# Altium schematic sheet STM32F103RxT_simple.SchDoc
size A4
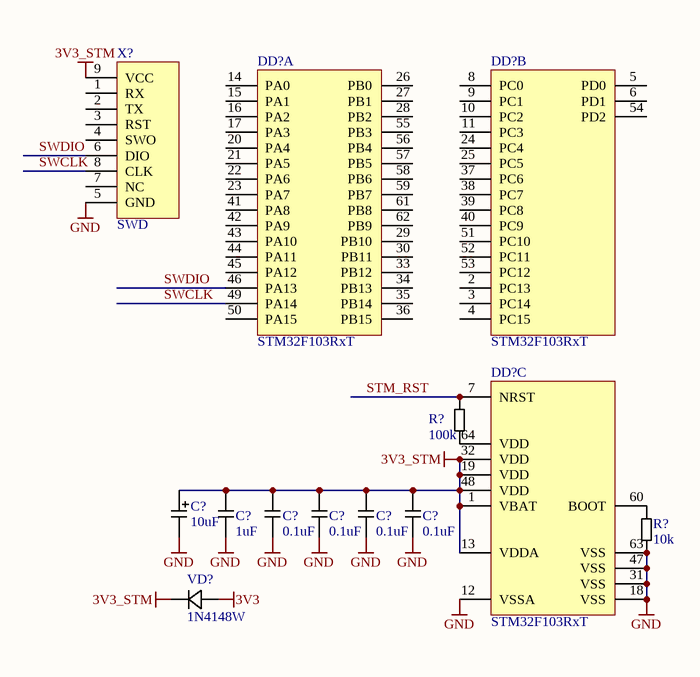
[diagram p0: STM32F103RxT_simple.SchDoc]

## Parts
(Parts that share a designator on the sheet are numbered #1, #2 ... from top to bottom, then left to right.)
C?#1  10uF  [SMD A]
C?#2  1uF  [C0603]
C?#3  0.1uF  [C0603]
C?#4  0.1uF  [C0603]
C?#5  0.1uF  [C0603]
C?#6  0.1uF  [C0603]
DD?#1  STM32F103RxT  [LQFP-64]  (part A of 3)
DD?#2  STM32F103RxT  [LQFP-64]  (part B of 3)
DD?#3  STM32F103RxT  [LQFP-64]  (part C of 3)
R?#1  100k  [R0603]
R?#2  10k  [R0603]
VD?  1N4148W  [SOD-123]
X?  SWD  [PogoSWD]

## Nets
3V3: VD?.1(K)
3V3_STM: C?#1.1 C?#2.1 C?#3.1 C?#4.1 C?#5.1 C?#6.1 DD?#3.1(VBAT) DD?#3.13(VDDA) DD?#3.19(VDD) DD?#3.32(VDD) DD?#3.48(VDD) VD?.2(A) X?.9(VCC)
GND: C?#1.2 C?#2.2 C?#3.2 C?#4.2 C?#5.2 C?#6.2 DD?#3.12(VSSA) DD?#3.18(VSS) DD?#3.31(VSS) DD?#3.47(VSS) DD?#3.63(VSS) R?#2.2 X?.5(GND)
STM_RST: DD?#3.7(NRST) R?#1.2
SWCLK: DD?#1.49(PA14) X?.8(CLK)
SWDIO: DD?#1.46(PA13) X?.6(DIO)
NetDD?#3_60: DD?#3.60(BOOT) R?#2.1
NetDD?#3_64: DD?#3.64(VDD) R?#1.1

Not connected (* = marked no-connect by the designer): DD?#1 14(PA0) 15(PA1) 16(PA2) 17(PA3) 20(PA4) 21(PA5) 22(PA6) 23(PA7) 26(PB0) 27(PB1) 28(PB2) 29(PB10) 30(PB11) 33(PB12) 34(PB13) 35(PB14) 36(PB15) 41(PA8) 42(PA9) 43(PA10) 44(PA11) 45(PA12) 50(PA15) 55(PB3) 56(PB4) 57(PB5) 58(PB6) 59(PB7) 61(PB8) 62(PB9); DD?#2 2(PC13) 3(PC14) 4(PC15) 5(PD0) 6(PD1) 8(PC0) 9(PC1) 10(PC2) 11(PC3) 24(PC4) 25(PC5) 37(PC6) 38(PC7) 39(PC8) 40(PC9) 51(PC10) 52(PC11) 53(PC12) 54(PD2); X? 1(RX) 2(TX) 3(RST) 4(SWO) 7(NC)

## Library data of the parts
C?#1 = CP: Capacitor polarized
C?#2-C?#6 = C: Capacitor
DD?#1-DD?#3 = STM32F103RxT: ST MCU with USB
R?#1 R?#2 = R: Resistor
VD? = Diode: SMD diode
X? = SWD-Pogo: SWD connector for PogoPins